# EAGLE design PicLEDThermometer (EAGLE 9.1.0)
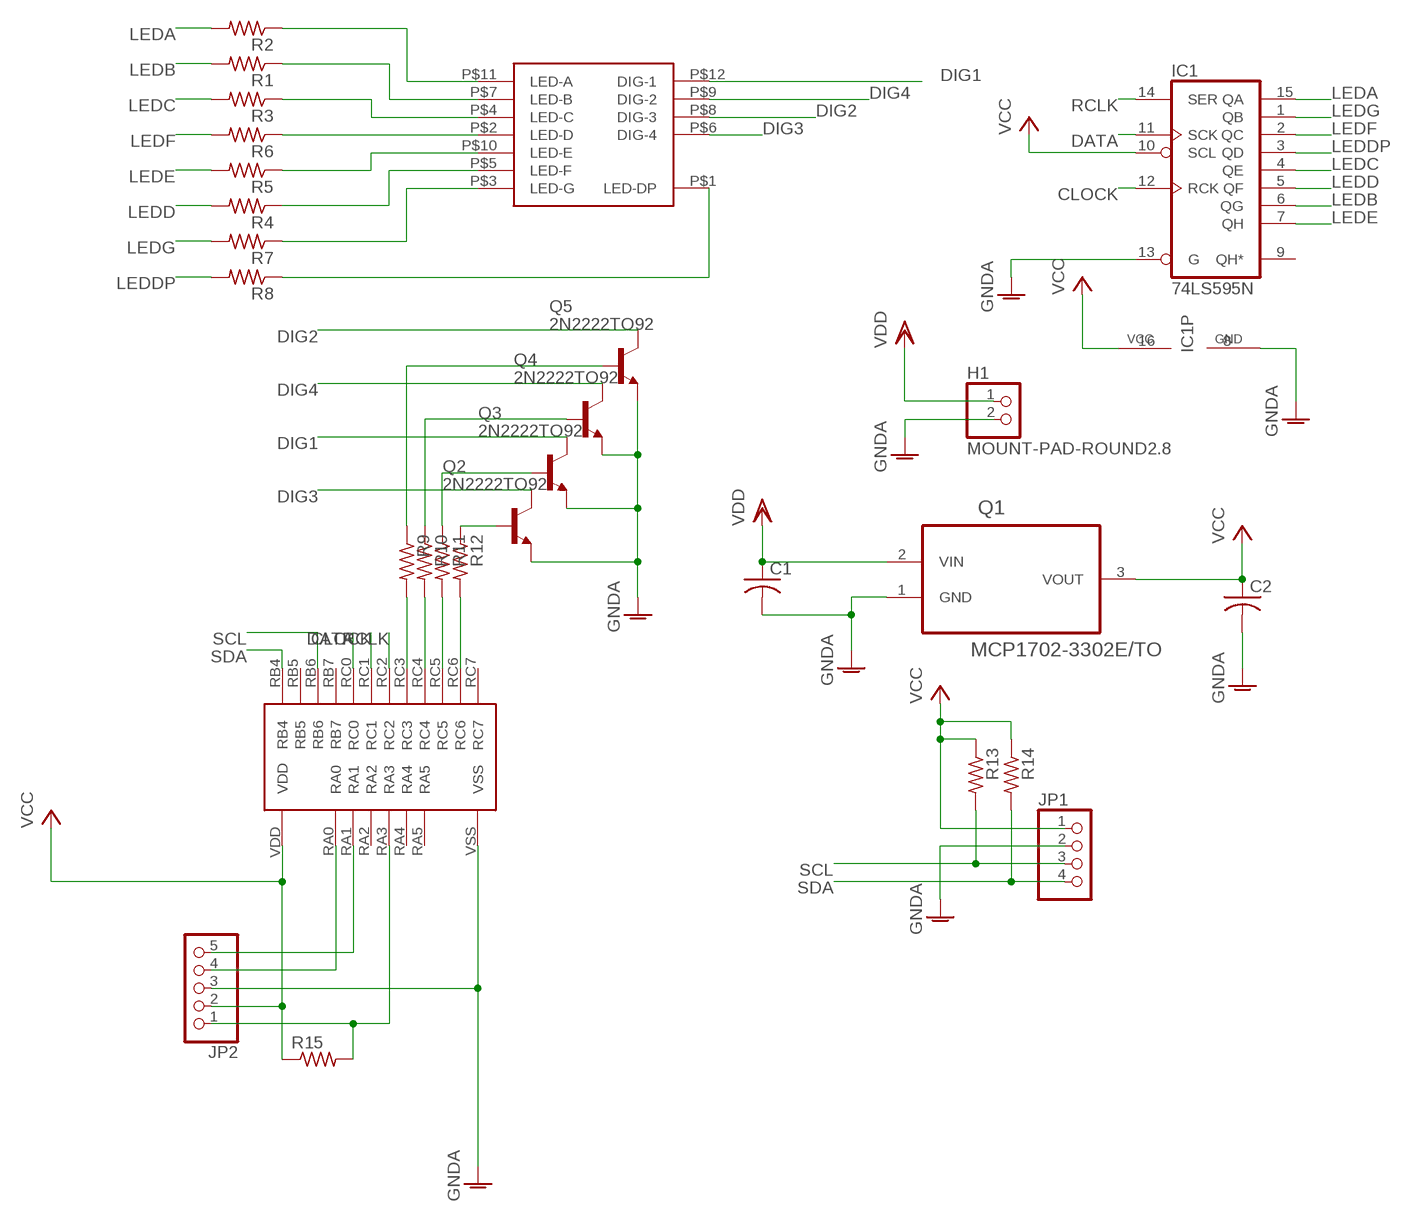
[diagram p0: schematic, sheet 1]

## Parts
C1  C-US025-030X050  [C025-030X050]
C2  C-US025-030X050  [C025-030X050]
H1  MOUNT-PAD-ROUND2.8  PINHD-1X2  [1X02]
IC1  74LS595N  [DIL16]
JP1  PINHD-1X4  [1X04]
JP2  PINHD-1X5  [1X05]
Q1  MCP1702-3302E/TO  [TO127P254X533-3]
Q2  2N2222TO92  [TO92-LINE]
Q3  2N2222TO92  [TO92-LINE]
Q4  2N2222TO92  [TO92-LINE]
Q5  2N2222TO92  [TO92-LINE]
R1  R-US_0207/10  [0207/10]
R2  R-US_0207/10  [0207/10]
R3  R-US_0207/10  [0207/10]
R4  R-US_0207/10  [0207/10]
R5  R-US_0207/10  [0207/10]
R6  R-US_0207/10  [0207/10]
R7  R-US_0207/10  [0207/10]
R8  R-US_0207/10  [0207/10]
R9  R-US_0207/10  [0207/10]
R10  R-US_0207/10  [0207/10]
R11  R-US_0207/10  [0207/10]
R12  R-US_0207/10  [0207/10]
R13  R-US_0207/10  [0207/10]
R14  R-US_0207/10  [0207/10]
R15  R-US_0207/10  [0207/10]
U$1  FYQ-5641  [FYQ-5641]
U$2  PIC16F1707  [PIC16F1707]

## Nets
CLOCK: IC1.12(RCK) U$2.RC1
DATA: IC1.11(SCK) U$2.RC0
DIG1: Q3.COL(C) U$1.P$12(DIG-1)
DIG2: Q5.COL(C) U$1.P$8(DIG-3)
DIG3: Q2.COL(C) U$1.P$6(DIG-4)
DIG4: Q4.COL(C) U$1.P$9(DIG-2)
GNDA: C1.2 C2.2 H1.2 IC1.8(GND) IC1.13(G) JP1.2 JP2.3 Q1.1(GND) Q2.EMIT(E) Q3.EMIT(E) Q4.EMIT(E) Q5.EMIT(E) U$2.VSS
LEDA: IC1.15(QA) R2.2
LEDB: IC1.6(QG) R1.2
LEDC: IC1.4(QE) R3.2
LEDD: IC1.5(QF) R4.2
LEDDP: IC1.3(QD) R8.2
LEDE: IC1.7(QH) R5.2
LEDF: IC1.2(QC) R6.2
LEDG: IC1.1(QB) R7.2
N$1: R2.1 U$1.P$11(LED-A)
N$2: R1.1 U$1.P$7(LED-B)
N$3: R3.1 U$1.P$4(LED-C)
N$4: R6.1 U$1.P$2(LED-D)
N$5: R5.1 U$1.P$10(LED-E)
N$6: R4.1 U$1.P$5(LED-F)
N$7: R7.1 U$1.P$3(LED-G)
N$8: JP2.1 R15.2 U$2.RA3
N$9: JP2.4 U$2.RA0
N$10: JP2.5 U$2.RA1
N$11: R12.2 U$2.RC6
N$12: R8.1 U$1.P$1(LED-DP)
N$13: R11.2 U$2.RC5
N$14: R10.2 U$2.RC4
N$15: R9.2 U$2.RC3
N$16: Q2.BASE(B) R12.1
N$17: Q3.BASE(B) R11.1
N$18: Q4.BASE(B) R10.1
N$19: Q5.BASE(B) R9.1
RCLK: IC1.14(SER) U$2.RC2
SCL: JP1.3 R13.2 U$2.RB6
SDA: JP1.4 R14.2 U$2.RB4
VCC: C2.1 IC1.10(SCL) IC1.16(VCC) JP1.1 JP2.2 Q1.3(VOUT) R13.1 R14.1 R15.1 U$2.VDD
VDD: C1.1 H1.1 Q1.2(VIN)
Unconnected: IC1.9(QH*) U$2.RA2 U$2.RA4 U$2.RA5 U$2.RB5 U$2.RB7 U$2.RC7

## Library data of the parts
C1 C2 = rcl:C-US: CAPACITOR, American symbol; SPICEPREFIX: C
H1 = pinhead:PINHD-1X2: PIN HEADER
IC1 = 74xx-us:74*595: 8-bit SHIFT REGISTER, output latch
JP1 = pinhead:PINHD-1X4: PIN HEADER
JP2 = pinhead:PINHD-1X5: PIN HEADER
Q1 = Microchip_By_element14_Batch_1:MCP1702-3302E/TO: IC, V REG, LDO, 250MA; MPN: MCP1702-3302E/TO; OC_FARNELL: 1331485; OC_NEWARK: 34M7419; PACKAGE: TO-92; SUPPLIER: Microchip
Q2-Q5 = 2n2222:2N2222*: NPN Transistor
R1-R15 = rcl:R-US_: RESISTOR, American symbol; SPICEPREFIX: R
U$1 = FYQ-5641:FYQ-5641
U$2 = PICMicros:PIC16F1707

## Board
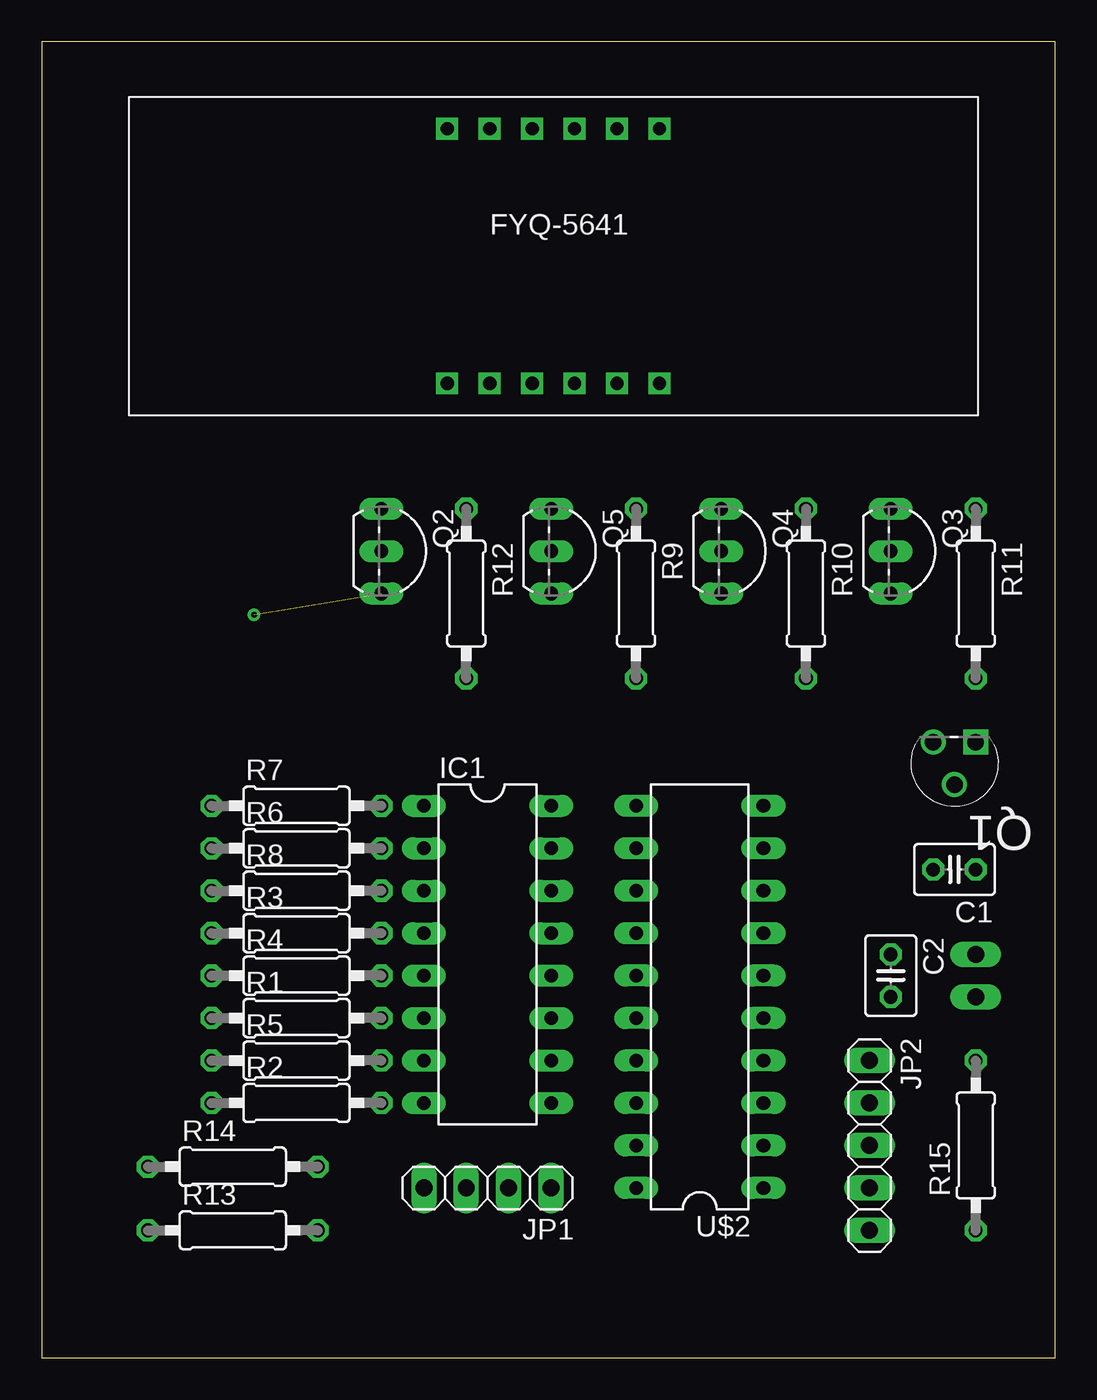
[diagram p1: board, top side]
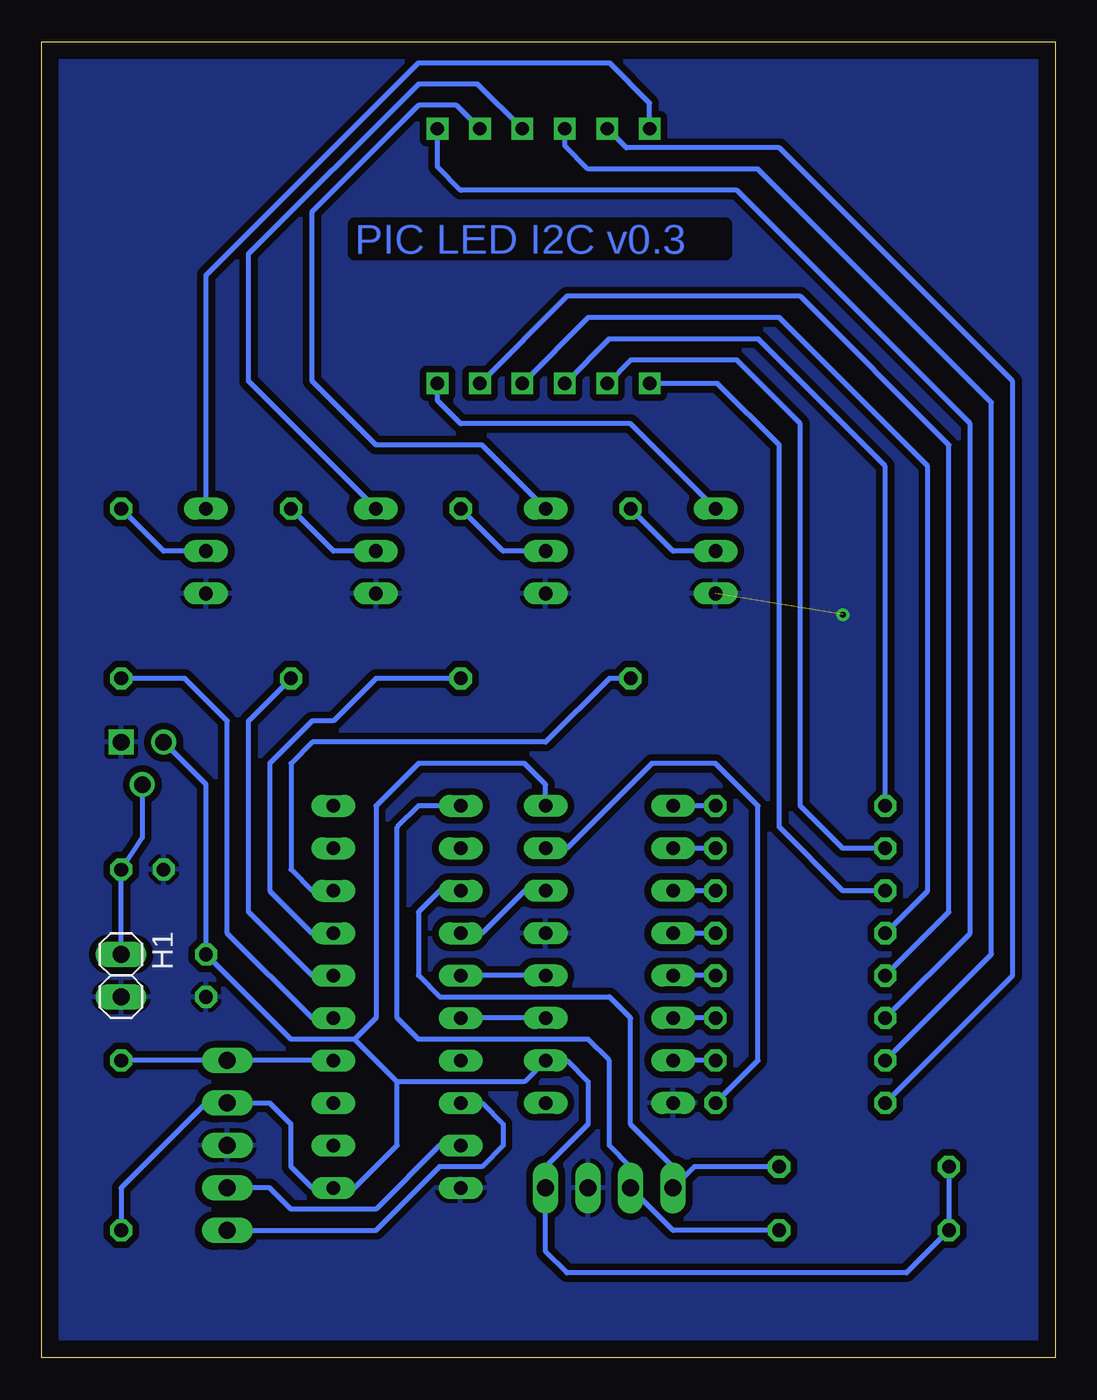
[diagram p2: board, bottom side, seen from below]

Size 60.63 x 78.73 mm. Coordinates in mm from the lower left corner, seen from the top.
Outline: 0,0 60.63,0 60.63,78.73 0,78.73 0,0
Copper layers (1*16): Top 0.035mm / dielectric 1.5mm / Bottom 0.035mm
Design rules "default": minimum track width 6mil, minimum drill 0.35mm, track to track 6mil, track to pad 6mil, pad to pad 6mil, via to via 6mil, smd to smd 6mil, copper to edge 40mil, drill to drill 6mil, minimum pad ring 10mil, minimum via ring 8mil, stop-mask expansion 4mil, vias tented up to drill 0mil, thermal gap 10mil

### Footprints (pad centres in the part's own frame; a part is rotated, then mirrored left to right if it is on the bottom)
C025-030X050 = drill 0.813 octagon: 1 -1.27,0; 2 1.27,0
1X02 = drill 1.016 long: 1 -1.27,0; 2 1.27,0
DIL16 = drill 0.813 long: 1 -8.89,-3.81; 2 -6.35,-3.81; 3 -3.81,-3.81; 4 -1.27,-3.81; 5 1.27,-3.81; 6 3.81,-3.81; 7 6.35,-3.81; 8 8.89,-3.81; 9 8.89,3.81; 10 6.35,3.81; 11 3.81,3.81; 12 1.27,3.81; 13 -1.27,3.81; 14 -3.81,3.81; 15 -6.35,3.81; 16 -8.89,3.81
1X04 = drill 1.016 long: 1 -3.81,0; 2 -1.27,0; 3 1.27,0; 4 3.81,0
1X05 = drill 1.016 long: 1 -5.08,0; 2 -2.54,0; 3 0,0; 4 2.54,0; 5 5.08,0
TO127P254X533-3 = drill 0.991 square: 1 -2.54,-2.54 | drill 0.991: 2 -1.27,0; 3 0,-2.54
TO92-LINE = drill 0.813 long: BASE 0,0; COL -2.54,0; EMIT 2.54,0
0207/10 = drill 0.813 octagon: 1 -5.08,0; 2 5.08,0
FYQ-5641 = drill 0.8 square: P$1 -6.35,-7.62; P$2 -3.81,-7.62; P$3 -1.27,-7.62; P$4 1.27,-7.62; P$5 3.81,-7.62; P$6 6.35,-7.62; P$7 6.35,7.62; P$8 3.81,7.62; P$9 1.27,7.62; P$10 -1.27,7.62; P$11 -3.81,7.62; P$12 -6.35,7.62
PIC16F1707 = drill 0.813 long: RA0 -8.89,3.81; RA1 -6.35,3.81; RA2 -3.81,3.81; RA3 -3.81,-3.81; RA4 -6.35,-3.81; RA5 -8.89,-3.81; RB4 6.35,3.81; RB5 8.89,3.81; RB6 11.43,3.81; RB7 11.43,-3.81; RC0 -1.27,3.81; RC1 1.27,3.81; RC2 3.81,3.81; RC3 3.81,-3.81; RC4 1.27,-3.81; RC5 -1.27,-3.81; RC6 6.35,-3.81; RC7 8.89,-3.81; VDD -11.43,-3.81; VSS -11.43,3.81

### Placement (x,y rotation side)
C1  54.61,29.21 180 top
C2  50.8,22.86 270 top
H1  55.88,22.86 270 bottom
IC1  26.67,24.13 270 top
JP1  26.67,10.16 180 top
JP2  49.53,12.7 270 top
Q1  53.34,34.29 180 top
Q2  20.32,48.26 270 top
Q3  50.8,48.26 270 top
Q4  40.64,48.26 270 top
Q5  30.48,48.26 270 top
R1  15.24,20.32 0 top
R2  15.24,15.24 0 top
R3  15.24,25.4 0 top
R4  15.24,22.86 0 top
R5  15.24,17.78 0 top
R6  15.24,30.48 0 top
R7  15.24,33.02 0 top
R8  15.24,27.94 0 top
R9  35.56,45.72 270 top
R10  45.72,45.72 270 top
R11  55.88,45.72 270 top
R12  25.4,45.72 270 top
R13  11.43,7.62 0 top
R14  11.43,11.43 0 top
R15  55.88,12.7 90 top
U$1  30.61,65.91 0 top
U$2  39.37,21.59 90 top

### Tracks (layer width: path | path; a pad name or v marks a point on that pad's centre or on a via)
CLOCK
  Bottom 0.305: IC1.12 U$2.RC1
DATA
  Bottom 0.305: IC1.11 U$2.RC0
DIG1
  Bottom 0.305: U$1.P$12 24.26,75.06 26.67,77.47 38.1,77.47 50.8,64.77 Q3.COL
DIG2
  Bottom 0.305: U$1.P$8 35.81,74.93 38.1,74.93 44.45,68.58 44.45,58.42 40.64,54.61 34.29,54.61 Q5.COL
DIG3
  Bottom 0.305: U$1.P$6 36.96,57.28 35.56,55.88 25.4,55.88 Q2.COL
DIG4
  Bottom 0.305: U$1.P$9 34.54,76.2 38.1,76.2 48.26,66.04 48.26,58.42 Q4.COL
GNDA  (via drill 0.35)  (1 unrouted)
  other vias: 12.7,44.45
  pour Bottom (isolate 0.406): 0,78.74 60.96,78.74 60.96,0 0,0
LEDA
  Bottom 0.305: R2.2 17.78,17.78 17.78,33.02 20.32,35.56 24.13,35.56 29.21,30.48 IC1.15
LEDB
  Bottom 0.305: R1.2 IC1.6
LEDC
  Bottom 0.305: R3.2 IC1.4
LEDD
  Bottom 0.305: R4.2 IC1.5
LEDDP
  Bottom 0.305: R8.2 IC1.3
LEDE
  Bottom 0.305: R5.2 IC1.7
LEDF
  Bottom 0.305: R6.2 IC1.2
LEDG
  Bottom 0.305: R7.2 IC1.1
N$1
  Bottom 0.305: R2.1 2.54,22.86 2.54,58.42 16.51,72.39 25.65,72.39 U$1.P$11
N$2
  Bottom 0.305: R1.1 5.08,25.4 5.08,55.88 19.05,69.85 35.56,69.85 36.96,71.25 U$1.P$7
N$3
  Bottom 0.305: R3.1 7.62,27.94 7.62,53.34 16.51,62.23 27.94,62.23 U$1.P$4
N$4
  Bottom 0.305: R6.1 12.7,30.48 15.24,33.02 15.24,55.88 19.05,59.69 25.4,59.69 U$1.P$2
N$5
  Bottom 0.305: R5.1 3.81,24.13 3.81,57.15 17.78,71.12 27.94,71.12 29.34,72.52 U$1.P$10
N$6
  Bottom 0.305: R4.1 6.35,26.67 6.35,54.61 15.24,63.5 29.21,63.5 U$1.P$5
N$7
  Bottom 0.305: U$1.P$3 26.67,60.96 17.78,60.96 10.16,53.34 R7.1
N$8
  Bottom 0.305: U$2.RA3 JP2.1 R15.2
N$9
  Bottom 0.305: U$2.RA0 36.83,12.7 40.64,8.89 45.72,8.89 46.99,10.16 JP2.4
N$10
  Bottom 0.305: U$2.RA1 34.29,15.24 33.02,13.97 33.02,12.7 34.29,11.43 36.83,11.43 40.64,7.62 JP2.5
N$11
  Bottom 0.305: R12.2 26.67,40.64 30.48,36.83 44.45,36.83 45.72,35.56 45.72,29.21 44.45,27.94 U$2.RC6
N$12
  Bottom 0.305: R8.1 12.7,27.94 16.51,31.75 16.51,54.61 20.19,58.29 U$1.P$1
N$13
  Bottom 0.305: U$2.RC5 44.45,20.32 49.53,25.4 49.53,38.1 52.07,40.64 R11.2
N$14
  Bottom 0.305: U$2.RC4 44.45,22.86 48.26,26.67 48.26,38.1 R10.2
N$15
  Bottom 0.305: R9.2 40.64,40.64 43.18,38.1 44.45,38.1 46.99,35.56 46.99,27.94 44.45,25.4 U$2.RC3
N$16
  Bottom 0.305: R12.1 22.86,48.26 Q2.BASE
N$17
  Bottom 0.305: Q3.BASE 53.34,48.26 R11.1
N$18
  Bottom 0.305: Q4.BASE 43.18,48.26 R10.1
N$19
  Bottom 0.305: R9.1 33.02,48.26 Q5.BASE
RCLK
  Bottom 0.305: IC1.14 31.75,27.94 34.29,25.4 U$2.RC2
SCL
  Bottom 0.305: U$2.RB6 38.1,33.02 39.37,31.75 39.37,20.32 38.1,19.05 27.94,19.05 26.67,17.78 26.67,12.7 25.4,11.43 JP1.3 22.86,7.62 R13.2
SDA
  Bottom 0.305: U$2.RB4 36.83,27.94 38.1,26.67 38.1,22.86 36.83,21.59 26.67,21.59 25.4,20.32 25.4,13.97 22.86,11.43 JP1.4 21.59,11.43 R14.2
VCC
  Bottom 0.305: Q1.3 50.8,34.29 C2.1 45.72,19.05 41.91,19.05 | IC1.16 30.48,34.29 31.75,35.56 38.1,35.56 40.64,33.02 40.64,20.32 41.91,19.05 | 39.37,16.51 31.75,16.51 IC1.10 29.21,17.78 27.94,16.51 27.94,13.97 30.48,11.43 JP1.1 30.48,6.35 29.21,5.08 8.89,5.08 R13.1 R14.1 | 39.37,16.51 41.91,19.05 | 39.37,16.51 39.37,12.7 41.91,10.16 U$2.VDD 44.45,10.16 45.72,11.43 45.72,13.97 46.99,15.24 JP2.2 50.8,15.24 55.88,10.16 R15.1
VDD
  Bottom 0.305: H1.1 C1.1 54.61,31.11 Q1.2

### Text on the board
Bottom: PIC LED I2C v0.3